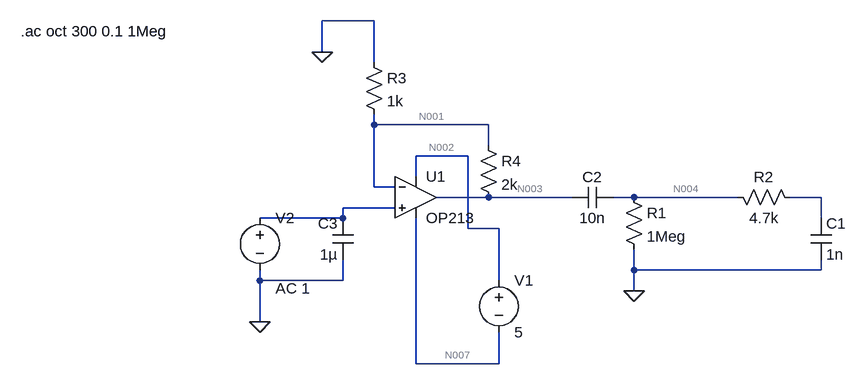
[diagram p0: schematic preamp simulation.asc]
preamp simulation.asc, the LTspice schematic file:
Version 4
SHEET 1 1656 680
WIRE 560 -128 480 -128
WIRE 480 -80 480 -128
WIRE 560 -64 560 -128
WIRE 560 32 560 16
WIRE 736 32 560 32
WIRE 736 64 736 32
WIRE 704 80 624 80
WIRE 624 112 624 80
WIRE 560 128 560 32
WIRE 592 128 560 128
WIRE 736 144 656 144
WIRE 864 144 736 144
WIRE 960 144 928 144
WIRE 1120 144 960 144
WIRE 1248 144 1200 144
WIRE 592 160 512 160
WIRE 512 176 512 160
WIRE 512 176 384 176
WIRE 1248 176 1248 144
WIRE 704 192 704 80
WIRE 752 192 704 192
WIRE 960 256 960 224
WIRE 1248 256 1248 240
WIRE 1248 256 960 256
WIRE 384 272 384 256
WIRE 512 272 512 240
WIRE 512 272 384 272
WIRE 752 272 752 192
WIRE 960 288 960 256
WIRE 384 336 384 272
WIRE 624 400 624 176
WIRE 752 400 752 352
WIRE 752 400 624 400
FLAG 480 -80 0
FLAG 960 288 0
FLAG 384 336 0
SYMBOL res 944 128 R0
SYMATTR InstName R1
SYMATTR Value 1Meg
SYMBOL cap 928 128 R90
WINDOW 0 0 32 VBottom 2
WINDOW 3 32 32 VTop 2
SYMATTR InstName C2
SYMATTR Value 10n
SYMBOL res 544 -80 R0
SYMATTR InstName R3
SYMATTR Value 1k
SYMBOL res 720 48 R0
SYMATTR InstName R4
SYMATTR Value 2k
SYMBOL voltage 752 256 R0
WINDOW 123 0 0 Left 0
WINDOW 39 0 0 Left 0
SYMATTR InstName V1
SYMATTR Value 5
SYMBOL voltage 384 160 R0
WINDOW 123 24 124 Left 2
WINDOW 39 0 0 Left 0
SYMATTR Value2 AC 1
SYMATTR InstName V2
SYMATTR Value ""
SYMBOL Opamps\\OP213 624 80 R0
SYMATTR InstName U1
SYMBOL cap 1232 176 R0
SYMATTR InstName C1
SYMATTR Value 1n
SYMBOL res 1104 128 M90
WINDOW 0 0 56 VBottom 2
WINDOW 3 32 56 VTop 2
SYMATTR InstName R2
SYMATTR Value 4.7k
SYMBOL cap 528 240 R180
WINDOW 0 24 56 Left 2
WINDOW 3 24 8 Left 2
SYMATTR InstName C3
SYMATTR Value 1µ
TEXT 16 -112 Left 2 !.ac oct 300 0.1 1Meg

The netlist it stands for:
* preamp simulation.asc
R1 N004 0 1Meg
C2 N004 N003 10n
R3 0 N001 1k
R4 N001 N003 2k
V1 N002 N007 5
V2 N006 0 AC 1
XU1 N006 N001 N002 N007 N003 OP213  ; pins In+ In- V+ V- OUT
C1 N005 0 1n
R2 N004 N005 4.7k
C3 0 N006 1µ
.ac oct 300 0.1 1Meg
.backanno
.end

* Results of the author's LTspice run, read from the files saved beside the schematic
* Operating Point, zero values left out:
*   V(n003) = -1.221 mV
*   V(n001) = -263.9 µV
*   V(n002) = -137.7 V
*   V(n007) = -142.7 V
*   I(R4) = 478.7 nA
*   I(R3) = 263.9 nA
*   I(V2) = 264.6 nA
*   I(V1) = -368.5 µA
*   Ix(u1:3) = -264.6 nA
*   Ix(u1:2) = -214.7 nA
*   Ix(u1:7) = 368.5 µA
*   Ix(u1:4) = -368.5 µA
*   Ix(u1:6) = 478.7 nA
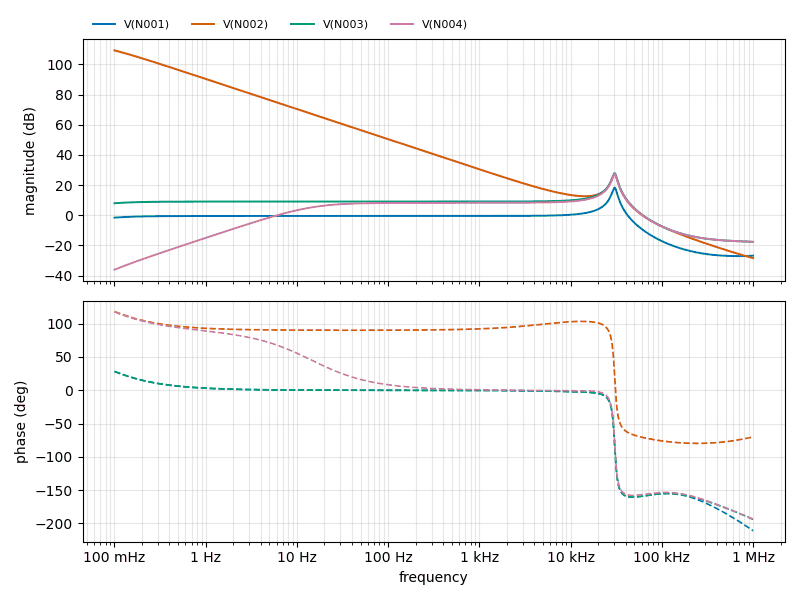
[diagram p1: AC Analysis of preamp simulation.asc, plotted from the saved traces]
* AC Analysis, 1 run:
*   V(N001): -1.54 dB at 100 mHz, -26.78 dB at 1 MHz, peak 18.36 dB at 30.39 kHz, 3 dB below the peak at 28.65 kHz and 31.99 kHz
*   V(N002): 109.32 dB at 100 mHz, -28.37 dB at 1 MHz, peak 109.32 dB at 100 mHz, 3 dB below the peak at 151.4 mHz
*   V(N003): 8.00 dB at 100 mHz, -17.58 dB at 1 MHz, peak 27.93 dB at 30.39 kHz, 3 dB below the peak at 28.65 kHz and 31.99 kHz
*   V(N004): -36.04 dB at 100 mHz, -17.58 dB at 1 MHz, peak 27.45 dB at 30.39 kHz, 3 dB below the peak at 28.66 kHz and 32 kHz